# EAGLE design 239_lux (EAGLE 9.6.2)
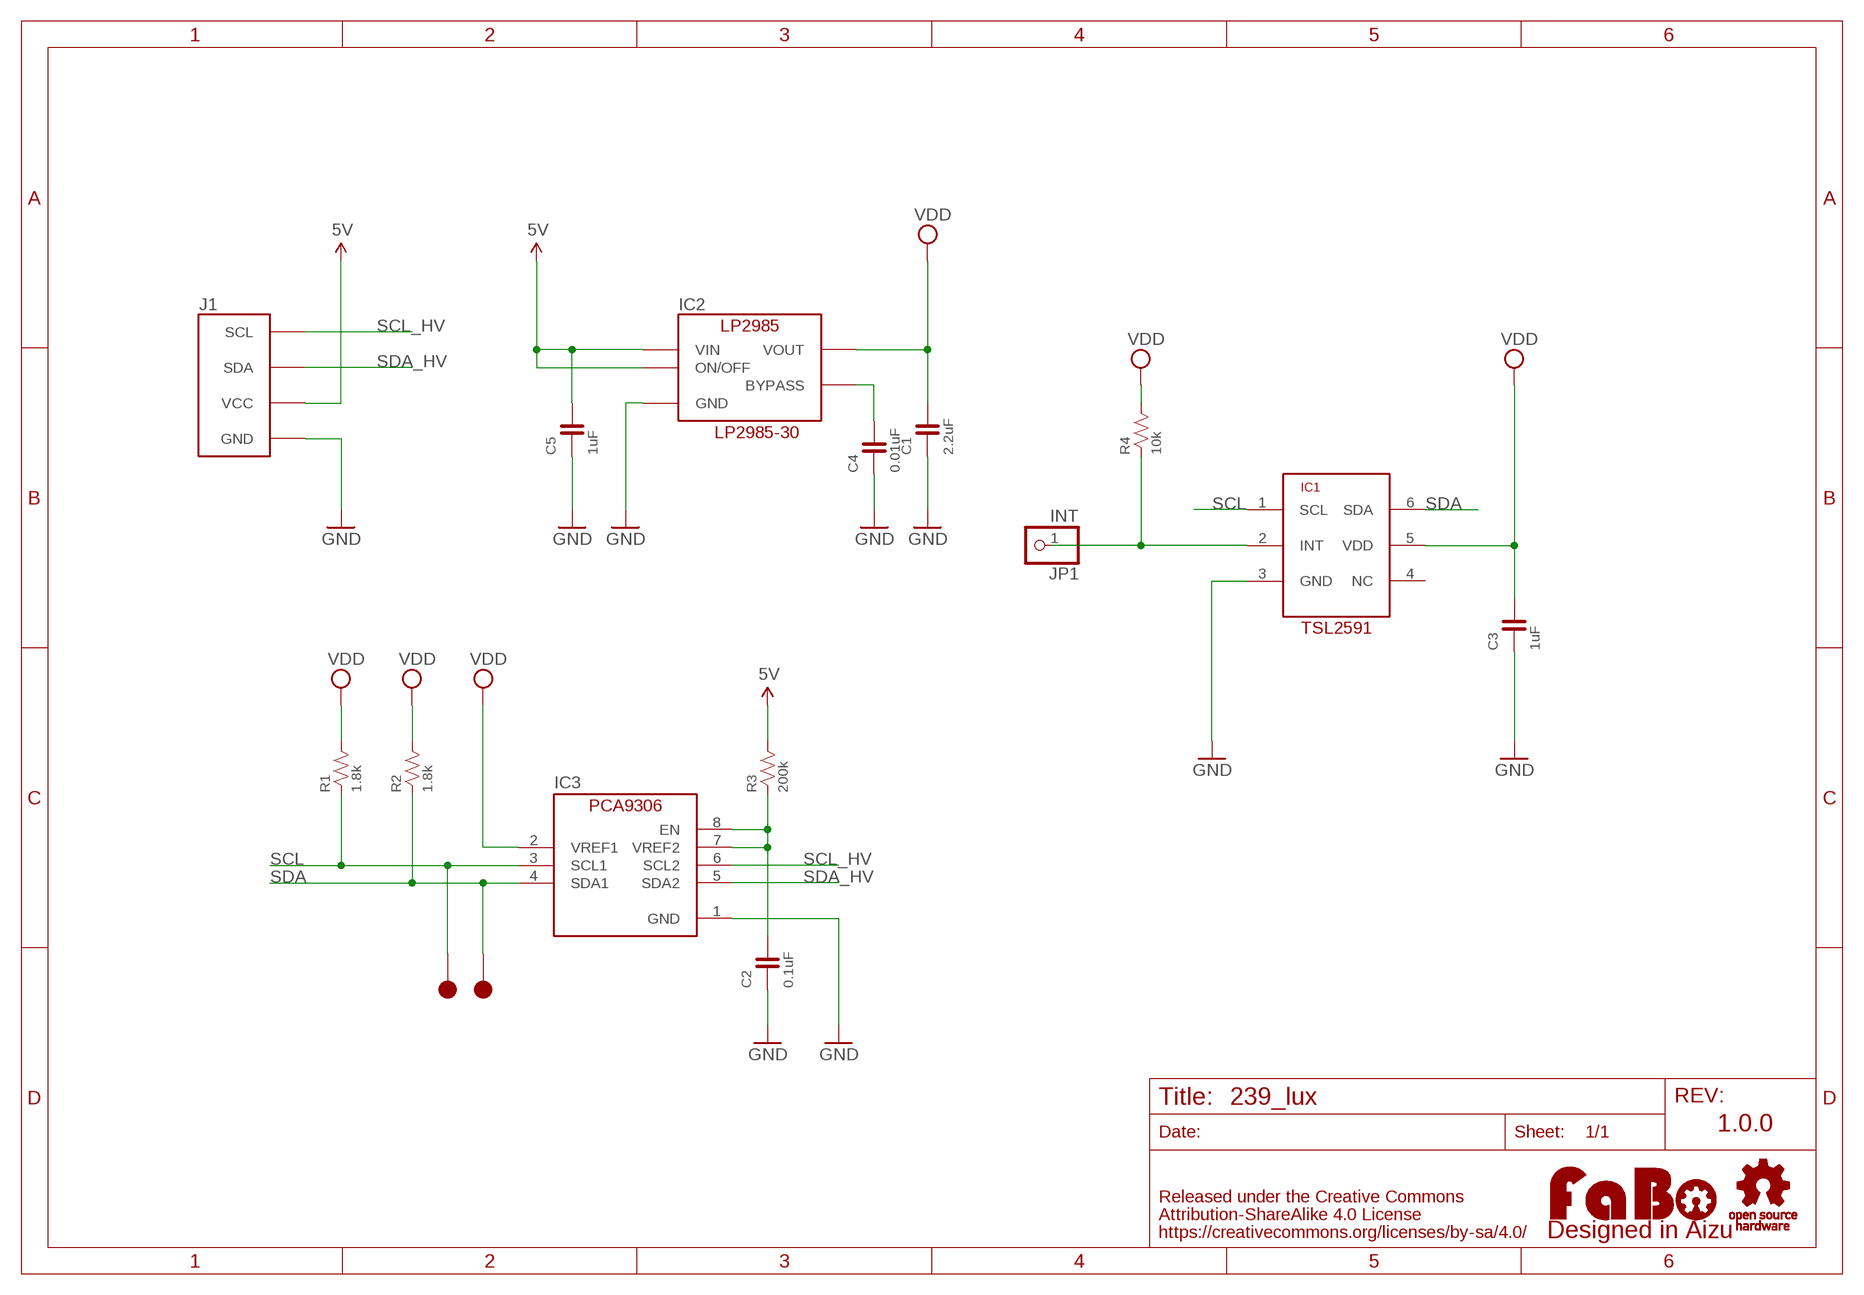
[diagram p0: schematic, sheet 1]

## Parts
C1  2.2uF  CAPACITOR-0603  [0603]
C2  0.1uF  CAPACITOR-0603  [0603]
C3  1uF  CAPACITOR-0603  [0603]
C4  0.01uF  CAPACITOR-0603  [0603]
C5  1uF  CAPACITOR-0603  [0603]
IC1  TSL2591  [TSL2591(SON)]
IC2  LP2985-33DBV  [SOT-23-5]
IC3  PCA9306_SSOP  [8PIN-SSOP]
J1  FABO_BRICK_I2C  [FABO_BRICK_I2C]
JP1  INT  PINHD-1X1  [1X01]
LOGO1  LOGO_FABO-M  [LOGO_FABO_M]
R1  1.8k  RESISTOR-0603  [0603]
R2  1.8k  RESISTOR-0603  [0603]
R3  200k  RESISTOR-0603  [0603]
R4  10k  RESISTOR-0603  [0603]
TP1  TP-15  [TP-15]
TP2  TP-15  [TP-15]
U$2  LOGO_OSHW-M_BOTTOM  [LOGO_OSHW_M_BOTTOM]

## Nets
5V: C5.2 IC2.1(VIN) IC2.3(ON/OFF) J1.VCC R3.2
GND: C1.1 C2.1 C3.1 C4.1 C5.1 IC1.3(GND) IC2.2(GND) IC3.1(GND) J1.GND
N$1: C4.2 IC2.4(BYPASS)
N$2: C2.2 IC3.7(VREF2) IC3.8(EN) R3.1
N$6: IC1.2(INT) JP1.1 R4.1
SCL: IC1.1(SCL) IC3.3(SCL1) R1.1 TP2.1
SCL_HV: IC3.6(SCL2) J1.SCL
SDA: IC1.6(SDA) IC3.4(SDA1) R2.1 TP1.1
SDA_HV: IC3.5(SDA2) J1.SDA
VDD: C1.2 C3.2 IC1.5(VDD) IC2.5(VOUT) IC3.2(VREF1) R1.2 R2.2 R4.2
Unconnected: IC1.4(NC)

## Notes on the sheet
- LP2985-30
- TSL2591
- 1.0.0

## Library data of the parts
C1-C5 = FaBo-Capacitor:CAPACITOR: CAPACITOR
IC1 = FaBo-Sensor:TSL2591
IC2 = FaBo-Supply:LP2985: LP2985
IC3 = FaBo-LevelTranslator:PCA9306
J1 = FaBo-Template:FABO_BRICK_I2C: FaBo Brick I2C
JP1 = pinhead:PINHD-1X1: PIN HEADER
LOGO1 = component:LOGO_FABO
R1-R4 = FaBo-Resistors:RESISTOR: RESISTOR
TP1 TP2 = FaBo-Supply:TP
U$2 = FaBo-etc:LOGO_OSHW

## Board
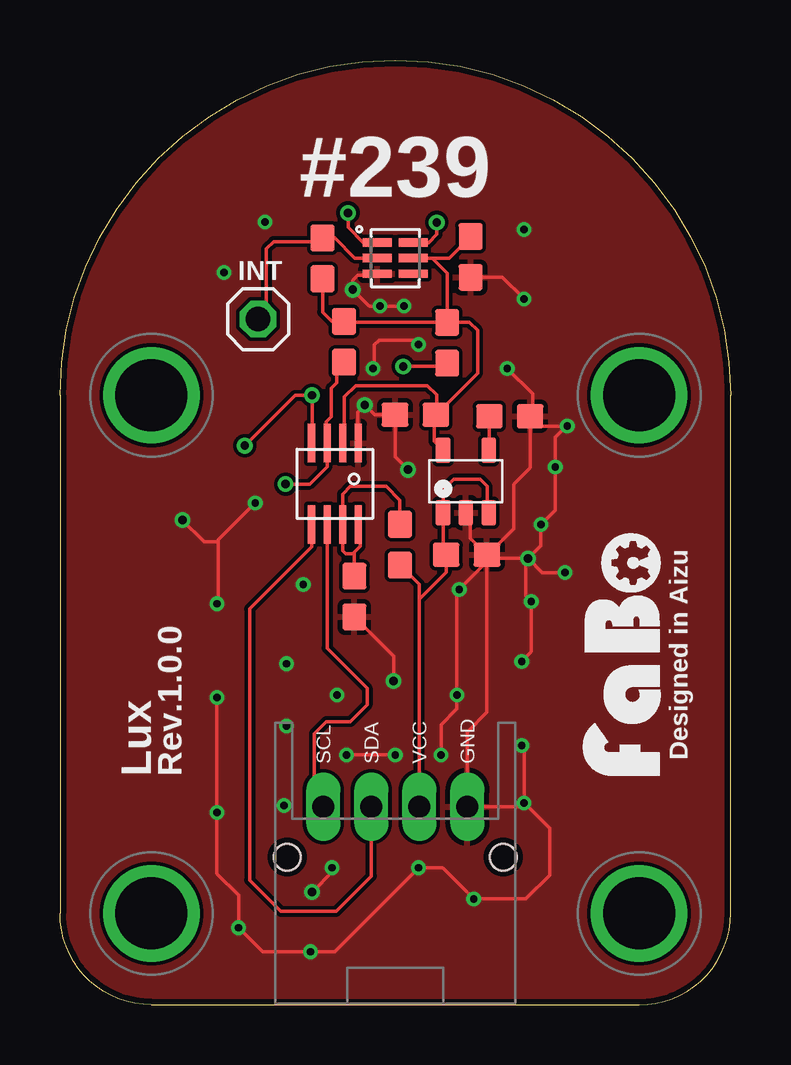
[diagram p1: board, top side]
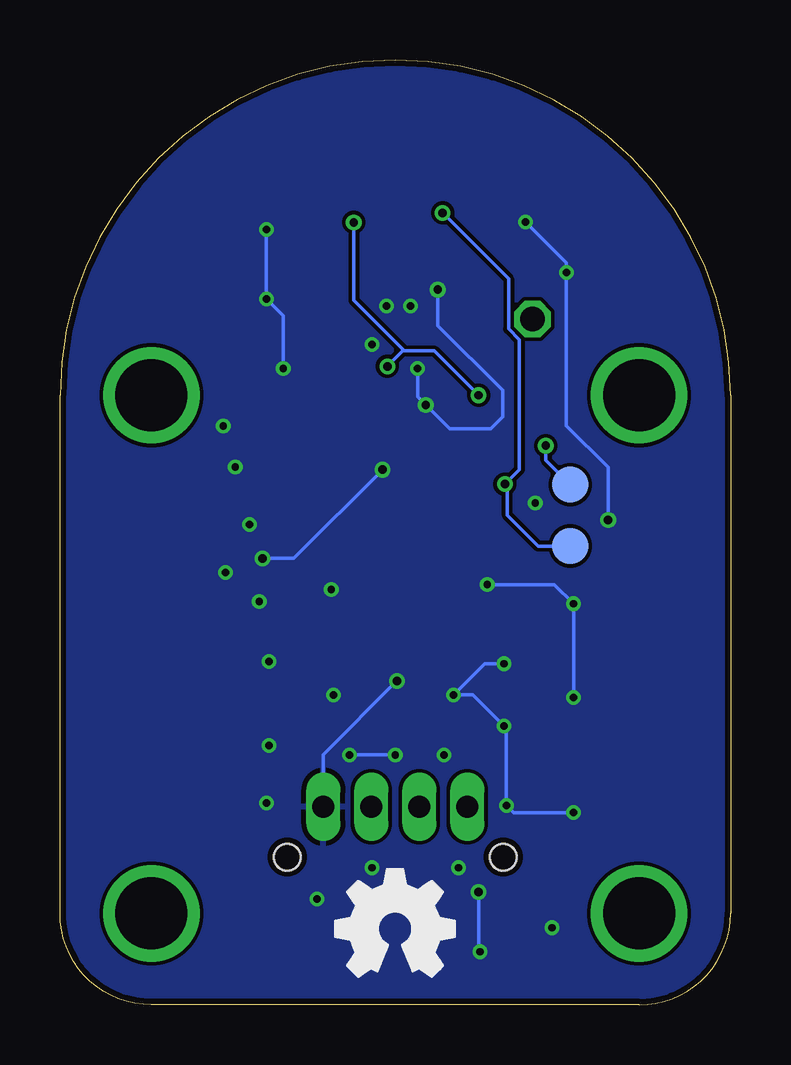
[diagram p2: board, bottom side, seen from below]

Size 27.94 x 39.37 mm. Coordinates in mm from the lower left corner, seen from the top.
Copper layers (1*16): Top 0.035mm / dielectric 1.6mm / Bottom 0.035mm
Design rules "PCBway": minimum track width 6mil, minimum drill 12mil, track to track 6mil, track to pad 6mil, pad to pad 6mil, via to via 6mil, smd to smd 6mil, copper to edge 10mil, drill to drill 10mil, minimum pad ring 10mil, minimum via ring 6mil, stop-mask expansion 2mil, vias tented up to drill 100mil, thermal gap 8mil
tRestrict: 1 lines

### Footprints (pad centres in the part's own frame; a part is rotated, then mirrored left to right if it is on the bottom)
0603 = smd 1.1 x 1: 1 -0.85,0; 2 0.85,0
TSL2591(SON) = smd 1.2 x 0.35: 1 -0.75,0.65; 2 -0.75,0; 3 -0.75,-0.65; 4 0.75,-0.65; 5 0.75,0; 6 0.75,0.65
SOT-23-5 = smd 0.6 x 1.05: 1 -0.95,-1.3; 2 0,-1.3; 3 0.95,-1.3; 4 0.95,1.3; 5 -0.95,1.3
8PIN-SSOP = smd 0.3 x 1.6: 1 -0.975,-1.7; 2 -0.325,-1.7; 3 0.325,-1.7; 4 0.975,-1.7; 5 0.975,1.7; 6 0.325,1.7; 7 -0.325,1.7; 8 -0.975,1.7
FABO_BRICK_I2C = drill 0.9 pad 1.422 long: GND 3,-10.795; SCL -3,-10.795; SDA -1,-10.795; VCC 1,-10.795 | drill 3 pad 3.81: P$1 -10.16,6.35; P$2 10.16,6.35; P$3 -10.16,-15.24; P$4 10.16,-15.24 | hole 1.1: -4.5,-12.895; 4.5,-12.895
1X01 = drill 1.016 octagon: 1 0,0
TP-15 = smd 1.5 x 1.5: 1 0,0

### Placement (x,y rotation side)
C1  14.81,24.59 0 top
C2  12.27,17.02 90 top
C3  17.11,31.16 90 top
C4  18.74,24.53 180 top
C5  16.94,18.75 180 top
IC1  13.97,31.11 0 top
IC2  16.91,21.81 0 top
IC3  11.46,21.71 180 top
J1  13.97,19.05 0 top
JP1  8.26,28.57 0 top
LOGO1  25.4,14.61 90 top
R1  11.83,27.63 90 top
R2  16.13,27.59 90 top
R3  14.16,19.18 270 top
R4  10.94,31.11 270 top
TP1  6.68,21.68 0 bottom
TP2  6.68,19.12 0 bottom
U$2  13.97,3.17 0 top

### Tracks (layer width: path | path; a pad name or v marks a point on that pad's centre or on a via)
5V
  Top 0.152: R3.2 14.97,17.52 14.97,16.9 | J1.VCC 14.97,16.9 | 14.97,16.9 16.09,18.02 C5.2 15.96,18.89 IC2.1 15.96,21.46 16.4,21.9 17.5,21.9 17.8,21.6 17.8,20.57 IC2.3
GND  (via drill 0.3, 0.35)
  Top 0.152: C5.1 18.9,19.84 18.9,21.7 19.59,22.39 19.59,24.4 | C5.1 17.79,18.5 | 17.79,18.5 17.79,12.19 16.97,11.37 J1.GND 19.18,8.26 v19.34,8.41 | IC2.2 17.1,20.32 17.1,19.45 17.72,18.82 | 17.72,18.82 C5.1 | C4.1 19.59,24.4 | C2.1 13.9,14.53 v13.9,13.5 | IC1.3 13.15,30.4 12.4,30.4 12.2,30.2 v12.2,29.8 12.89,29.11 v13.34,29.11 v14.34,29.11 | IC3.1 12.4,23.44 12.4,24.7 v12.7,25 13.12,24.59 C1.1 13.96,22.84 v14.5,22.3 | v19.5,18.6 19.4,18.6 | 19.4,18.6 17.89,18.6 17.79,18.5 | C3.1 18.44,30.32 v19.34,29.41 | v21.14,24.11 21.1,24.11 | 21.1,24.11 19.88,24.11 19.7,24.3 | 19.7,24.3 19.59,24.4 | v18.64,26.51 19.7,25.46 19.7,24.3 | 21.1,24.11 20.64,23.65 v20.64,22.41 20.64,20.61 v20.04,20.01 20.04,19.14 v19.5,18.6 | v19.5,18.6 20.09,18.01 v21.04,18.01 | 19.4,18.6 19.4,17.05 v19.64,16.81 19.64,14.71 v19.24,14.31 | v15.88,10.41 15.88,11.68 16.54,12.34 v16.54,12.91 16.54,17.21 v16.64,17.31 17.72,18.4 17.72,18.82 | v6.54,12.81 v6.54,8.01 6.54,5.46 7.44,4.56 v7.44,3.21 8.44,2.21 v10.44,2.21 11.44,2.21 v14.94,5.71 15.94,5.71 v17.24,4.41 19.41,4.41 20.4,5.4 20.4,7.35 v19.34,8.41 | v19.34,8.41 19.34,10.71 v19.24,10.81 | v11.94,10.41 v13.97,10.41 | v8.14,20.91 6.6,19.38 6.6,19.3 | v6.54,16.71 6.6,16.78 6.6,19.3 | v13.04,26.51 13.1,26.58 13.1,27.5 13.3,27.7 14.75,27.7 v14.94,27.51 | v5.1,20.2 6,19.3 6.6,19.3 | v11.34,5.71 11.34,5.54 v10.5,4.7
  Bottom 0.152: v13.9,13.5 16.97,10.43 J1.GND | v12.2,29.8 12.2,28.3 9.5,25.6 9.5,24.5 10,24 11.7,24 v12.7,25 13.04,25.34 v13.04,26.51 | v14.5,22.3 18.2,18.6 v19.5,18.6 | v18.64,26.51 18.64,28.71 v19.34,29.41 v19.34,32.31 | v15.88,10.41 v13.97,10.41 | v9.44,14.21 10.24,14.21 v11.54,12.91 10.74,12.91 v9.44,11.61 9.34,11.51 v9.34,8.31 9.04,8.01 v6.54,8.01 | v10.14,17.51 7.34,17.51 v6.54,16.71 v6.54,12.81 | v8.54,32.61 6.84,30.91 v6.84,30.51 6.84,24.14 5.1,22.4 v5.1,20.2 | v10.5,4.7 10.5,2.28 v10.44,2.21
  pour Bottom: 0,0 27.94,0 27.94,39.37 0,39.37
  pour Top: 0,0 27.94,0 27.94,39.37 0,39.37
N$1
  Top 0.152: 17.96,24.46 C4.2 17.89,23.14 IC2.4
N$2
  Top 0.152: C2.2 12.27,18.8 | 12.27,18.8 12.27,18.86 12.5,19.1 12.5,19.94 IC3.8 | R3.1 14.16,21.04 13.6,21.6 12.1,21.6 11.78,21.28 IC3.7 11.78,18.92 11.9,18.8 12.27,18.8
N$6
  Top 0.152: JP1.1 8.6,28.92 8.6,31.5 8.9,31.8 10.79,31.8 R4.1 11.45,31.95 12.29,31.11 IC1.2
SCL  (via drill 0.35)
  Top 0.152: IC1.1 12.63,31.77 12,32.4 v12,33 | v9.4,21.7 10.4,21.7 11.13,22.43 IC3.3 11.1,23.44 11.1,24.3 11.3,24.5 11.3,25.7 11.53,25.93 11.53,26.48 R1.1
  Bottom 0.152: v12,33 9.25,30.25 9.25,28.16 8.8,27.72 8.8,22.3 9.3,21.8 | 9.3,21.8 v9.4,21.7 | TP2.1 8.02,19.12 9.3,20.4 9.3,21.8
SCL_HV
  Top 0.152: 11.13,8.41 J1.SCL 10.6,8.62 10.6,11.3 11.1,11.8 12.1,11.8 12.8,12.5 12.8,13.2 11.13,14.87 IC3.6
SDA  (via drill 0.35)
  Top 0.152: IC1.6 15.37,31.77 15.7,32.1 v15.7,32.6 | IC3.4 10.5,23.43 v10.5,25.4 9.8,25.4 v7.7,23.3 | R2.1 15.99,26.6 v14.3,26.6
  Bottom 0.152: v10.5,25.4 12.35,27.25 13.6,27.25 | v14.3,26.6 13.65,27.25 13.6,27.25 | TP1.1 7.7,22.7 v7.7,23.3 | 13.6,27.25 15.7,29.35 v15.7,32.6
SDA_HV
  Top 0.152: J1.SDA 12.97,5.37 11.5,3.9 9.2,3.9 7.9,5.2 7.9,16.5 10.48,19.08 IC3.5
VDD
  Top 0.152: 15.36,24.29 15.59,24.51 | 15.59,24.51 C1.2 15.69,24.61 | IC2.5 15.59,23.48 15.59,24.51 | R4.2 10.94,28.86 11.32,28.48 R1.2 11.87,28.44 R2.2 | IC1.5 15.5,31.11 | 15.5,31.11 16.21,31.11 C3.2 | R2.2 16.13,30.48 15.5,31.11 | 15.69,24.61 17.4,26.32 17.4,28.1 17.06,28.44 R2.2 | IC3.2 11.84,23.47 11.84,25.33 12.31,25.8 15.3,25.8 15.69,25.41 15.69,24.61

### Text on the board
tPlace: #239 | INT | Designed in Aizu | Lux | Rev.1.0.0